# Altium schematic sheet FPGA BANK.SchDoc
size A3
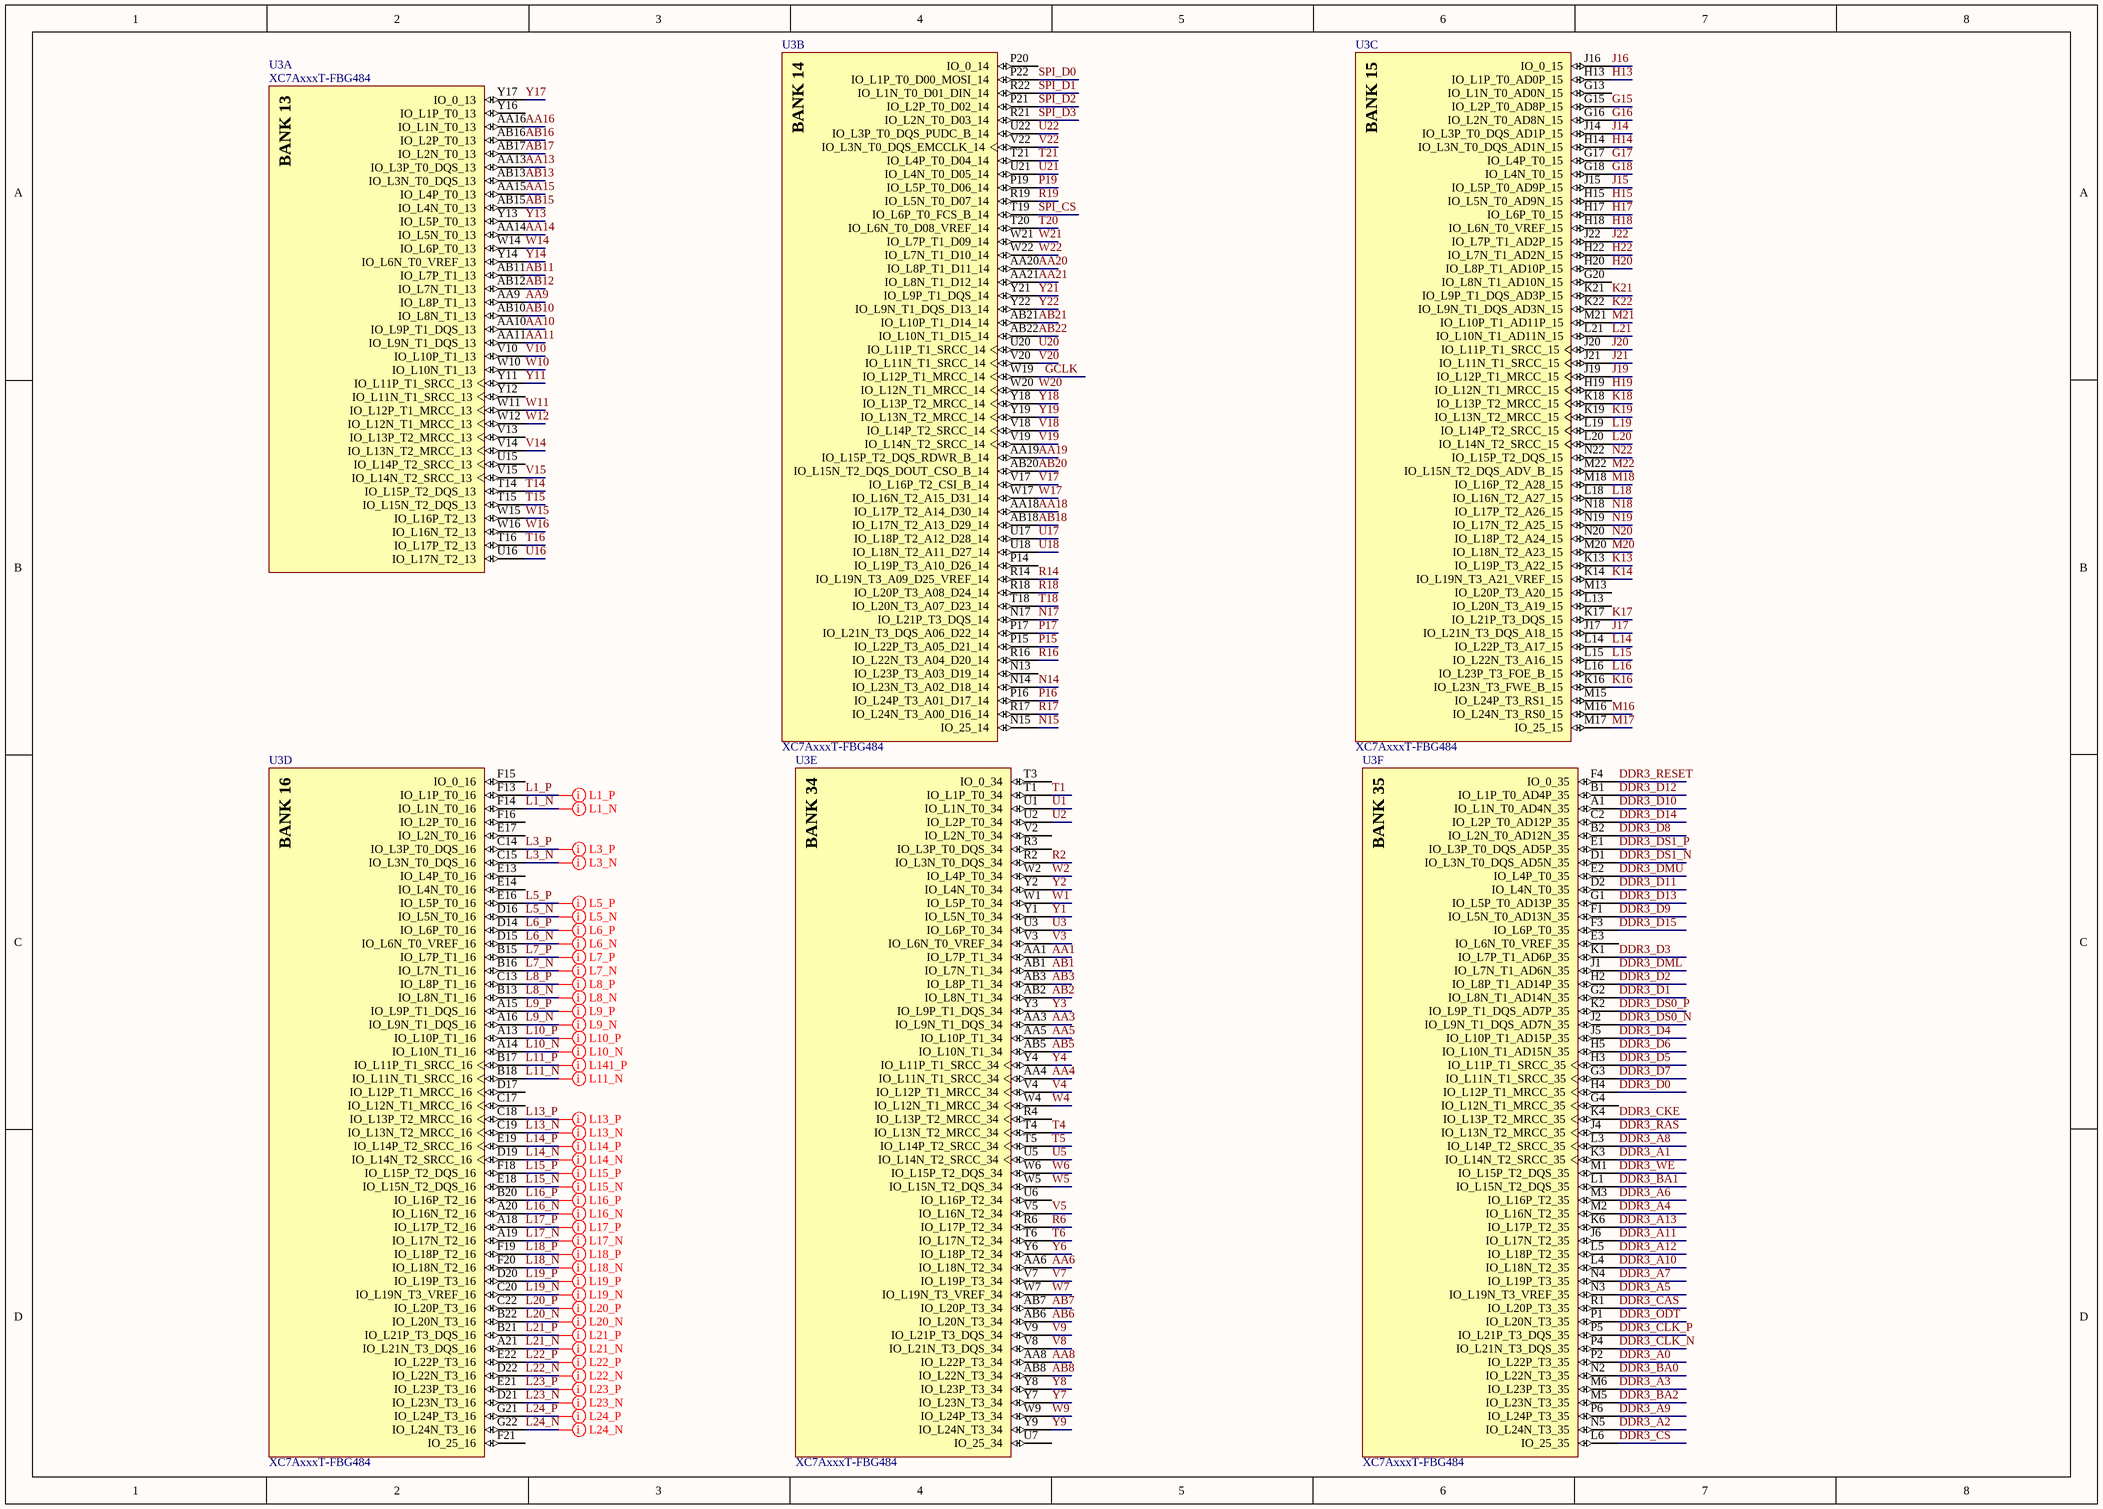
[diagram p0: FPGA BANK.SchDoc]

## Parts
U3  XC7AxxxT-FBG484  [FBG484]  (parts A,B,C,D,E,F of 11)

## Nets
AA1: U3.AA1(IO_L7P_T1_34)
AA3: U3.AA3(IO_L9N_T1_DQS_34)
AA4: U3.AA4(IO_L11N_T1_SRCC_34)
AA5: U3.AA5(IO_L10P_T1_34)
AA6: U3.AA6(IO_L18N_T2_34)
AA8: U3.AA8(IO_L22P_T3_34)
AA9: U3.AA9(IO_L8P_T1_13)
AA10: U3.AA10(IO_L9P_T1_DQS_13)
AA11: U3.AA11(IO_L9N_T1_DQS_13)
AA13: U3.AA13(IO_L3P_T0_DQS_13)
AA14: U3.AA14(IO_L5N_T0_13)
AA15: U3.AA15(IO_L4P_T0_13)
AA16: U3.AA16(IO_L1N_T0_13)
AA18: U3.AA18(IO_L17P_T2_A14_D30_14)
AA19: U3.AA19(IO_L15P_T2_DQS_RDWR_B_14)
AA20: U3.AA20(IO_L8P_T1_D11_14)
AA21: U3.AA21(IO_L8N_T1_D12_14)
AB1: U3.AB1(IO_L7N_T1_34)
AB2: U3.AB2(IO_L8N_T1_34)
AB3: U3.AB3(IO_L8P_T1_34)
AB5: U3.AB5(IO_L10N_T1_34)
AB6: U3.AB6(IO_L20N_T3_34)
AB7: U3.AB7(IO_L20P_T3_34)
AB8: U3.AB8(IO_L22N_T3_34)
AB10: U3.AB10(IO_L8N_T1_13)
AB11: U3.AB11(IO_L7P_T1_13)
AB12: U3.AB12(IO_L7N_T1_13)
AB13: U3.AB13(IO_L3N_T0_DQS_13)
AB15: U3.AB15(IO_L4N_T0_13)
AB16: U3.AB16(IO_L2P_T0_13)
AB17: U3.AB17(IO_L2N_T0_13)
AB18: U3.AB18(IO_L17N_T2_A13_D29_14)
AB20: U3.AB20(IO_L15N_T2_DQS_DOUT_CSO_B_14)
AB21: U3.AB21(IO_L10P_T1_D14_14)
AB22: U3.AB22(IO_L10N_T1_D15_14)
DDR3_A0: U3.P2(IO_L22P_T3_35)
DDR3_A1: U3.K3(IO_L14N_T2_SRCC_35)
DDR3_A2: U3.N5(IO_L24N_T3_35)
DDR3_A3: U3.M6(IO_L23P_T3_35)
DDR3_A4: U3.M2(IO_L16N_T2_35)
DDR3_A5: U3.N3(IO_L19N_T3_VREF_35)
DDR3_A6: U3.M3(IO_L16P_T2_35)
DDR3_A7: U3.N4(IO_L19P_T3_35)
DDR3_A8: U3.L3(IO_L14P_T2_SRCC_35)
DDR3_A9: U3.P6(IO_L24P_T3_35)
DDR3_A10: U3.L4(IO_L18N_T2_35)
DDR3_A11: U3.J6(IO_L17N_T2_35)
DDR3_A12: U3.L5(IO_L18P_T2_35)
DDR3_A13: U3.K6(IO_L17P_T2_35)
DDR3_BA0: U3.N2(IO_L22N_T3_35)
DDR3_BA1: U3.L1(IO_L15N_T2_DQS_35)
DDR3_BA2: U3.M5(IO_L23N_T3_35)
DDR3_CAS: U3.R1(IO_L20P_T3_35)
DDR3_CKE: U3.K4(IO_L13P_T2_MRCC_35)
DDR3_CLK_N: U3.P4(IO_L21N_T3_DQS_35)
DDR3_CLK_P: U3.P5(IO_L21P_T3_DQS_35)
DDR3_CS: U3.L6(IO_25_35)
DDR3_D0: U3.H4(IO_L12P_T1_MRCC_35)
DDR3_D1: U3.G2(IO_L8N_T1_AD14N_35)
DDR3_D2: U3.H2(IO_L8P_T1_AD14P_35)
DDR3_D3: U3.K1(IO_L7P_T1_AD6P_35)
DDR3_D4: U3.J5(IO_L10P_T1_AD15P_35)
DDR3_D5: U3.H3(IO_L11P_T1_SRCC_35)
DDR3_D6: U3.H5(IO_L10N_T1_AD15N_35)
DDR3_D7: U3.G3(IO_L11N_T1_SRCC_35)
DDR3_D8: U3.B2(IO_L2N_T0_AD12N_35)
DDR3_D9: U3.F1(IO_L5N_T0_AD13N_35)
DDR3_D10: U3.A1(IO_L1N_T0_AD4N_35)
DDR3_D11: U3.D2(IO_L4N_T0_35)
DDR3_D12: U3.B1(IO_L1P_T0_AD4P_35)
DDR3_D13: U3.G1(IO_L5P_T0_AD13P_35)
DDR3_D14: U3.C2(IO_L2P_T0_AD12P_35)
DDR3_D15: U3.F3(IO_L6P_T0_35)
DDR3_DML: U3.J1(IO_L7N_T1_AD6N_35)
DDR3_DMU: U3.E2(IO_L4P_T0_35)
DDR3_DS0_N: U3.J2(IO_L9N_T1_DQS_AD7N_35)
DDR3_DS0_P: U3.K2(IO_L9P_T1_DQS_AD7P_35)
DDR3_DS1_N: U3.D1(IO_L3N_T0_DQS_AD5N_35)
DDR3_DS1_P: U3.E1(IO_L3P_T0_DQS_AD5P_35)
DDR3_ODT: U3.P1(IO_L20N_T3_35)
DDR3_RAS: U3.J4(IO_L13N_T2_MRCC_35)
DDR3_RESET: U3.F4(IO_0_35)
DDR3_WE: U3.M1(IO_L15P_T2_DQS_35)
G15: U3.G15(IO_L2P_T0_AD8P_15)
G16: U3.G16(IO_L2N_T0_AD8N_15)
G17: U3.G17(IO_L4P_T0_15)
G18: U3.G18(IO_L4N_T0_15)
GCLK: U3.W19(IO_L12P_T1_MRCC_14)
H13: U3.H13(IO_L1P_T0_AD0P_15)
H14: U3.H14(IO_L3N_T0_DQS_AD1N_15)
H15: U3.H15(IO_L5N_T0_AD9N_15)
H17: U3.H17(IO_L6P_T0_15)
H18: U3.H18(IO_L6N_T0_VREF_15)
H19: U3.H19(IO_L12N_T1_MRCC_15)
H20: U3.H20(IO_L8P_T1_AD10P_15)
H22: U3.H22(IO_L7N_T1_AD2N_15)
J14: U3.J14(IO_L3P_T0_DQS_AD1P_15)
J15: U3.J15(IO_L5P_T0_AD9P_15)
J16: U3.J16(IO_0_15)
J17: U3.J17(IO_L21N_T3_DQS_A18_15)
J19: U3.J19(IO_L12P_T1_MRCC_15)
J20: U3.J20(IO_L11P_T1_SRCC_15)
J21: U3.J21(IO_L11N_T1_SRCC_15)
J22: U3.J22(IO_L7P_T1_AD2P_15)
K13: U3.K13(IO_L19P_T3_A22_15)
K14: U3.K14(IO_L19N_T3_A21_VREF_15)
K16: U3.K16(IO_L23N_T3_FWE_B_15)
K17: U3.K17(IO_L21P_T3_DQS_15)
K18: U3.K18(IO_L13P_T2_MRCC_15)
K19: U3.K19(IO_L13N_T2_MRCC_15)
K21: U3.K21(IO_L9P_T1_DQS_AD3P_15)
K22: U3.K22(IO_L9N_T1_DQS_AD3N_15)
L1_N: U3.F14(IO_L1N_T0_16)
L1_P: U3.F13(IO_L1P_T0_16)
L3_N: U3.C15(IO_L3N_T0_DQS_16)
L3_P: U3.C14(IO_L3P_T0_DQS_16)
L5_N: U3.D16(IO_L5N_T0_16)
L5_P: U3.E16(IO_L5P_T0_16)
L6_N: U3.D15(IO_L6N_T0_VREF_16)
L6_P: U3.D14(IO_L6P_T0_16)
L7_N: U3.B16(IO_L7N_T1_16)
L7_P: U3.B15(IO_L7P_T1_16)
L8_N: U3.B13(IO_L8N_T1_16)
L8_P: U3.C13(IO_L8P_T1_16)
L9_N: U3.A16(IO_L9N_T1_DQS_16)
L9_P: U3.A15(IO_L9P_T1_DQS_16)
L10_N: U3.A14(IO_L10N_T1_16)
L10_P: U3.A13(IO_L10P_T1_16)
L11_N: U3.B18(IO_L11N_T1_SRCC_16)
L11_P: U3.B17(IO_L11P_T1_SRCC_16)
L13_N: U3.C19(IO_L13N_T2_MRCC_16)
L13_P: U3.C18(IO_L13P_T2_MRCC_16)
L14: U3.L14(IO_L22P_T3_A17_15)
L14_N: U3.D19(IO_L14N_T2_SRCC_16)
L14_P: U3.E19(IO_L14P_T2_SRCC_16)
L15: U3.L15(IO_L22N_T3_A16_15)
L15_N: U3.E18(IO_L15N_T2_DQS_16)
L15_P: U3.F18(IO_L15P_T2_DQS_16)
L16: U3.L16(IO_L23P_T3_FOE_B_15)
L16_N: U3.A20(IO_L16N_T2_16)
L16_P: U3.B20(IO_L16P_T2_16)
L17_N: U3.A19(IO_L17N_T2_16)
L17_P: U3.A18(IO_L17P_T2_16)
L18: U3.L18(IO_L16N_T2_A27_15)
L18_N: U3.F20(IO_L18N_T2_16)
L18_P: U3.F19(IO_L18P_T2_16)
L19: U3.L19(IO_L14P_T2_SRCC_15)
L19_N: U3.C20(IO_L19N_T3_VREF_16)
L19_P: U3.D20(IO_L19P_T3_16)
L20: U3.L20(IO_L14N_T2_SRCC_15)
L20_N: U3.B22(IO_L20N_T3_16)
L20_P: U3.C22(IO_L20P_T3_16)
L21: U3.L21(IO_L10N_T1_AD11N_15)
L21_N: U3.A21(IO_L21N_T3_DQS_16)
L21_P: U3.B21(IO_L21P_T3_DQS_16)
L22_N: U3.D22(IO_L22N_T3_16)
L22_P: U3.E22(IO_L22P_T3_16)
L23_N: U3.D21(IO_L23N_T3_16)
L23_P: U3.E21(IO_L23P_T3_16)
L24_N: U3.G22(IO_L24N_T3_16)
L24_P: U3.G21(IO_L24P_T3_16)
M16: U3.M16(IO_L24N_T3_RS0_15)
M17: U3.M17(IO_25_15)
M18: U3.M18(IO_L16P_T2_A28_15)
M20: U3.M20(IO_L18N_T2_A23_15)
M21: U3.M21(IO_L10P_T1_AD11P_15)
M22: U3.M22(IO_L15N_T2_DQS_ADV_B_15)
N14: U3.N14(IO_L23N_T3_A02_D18_14)
N15: U3.N15(IO_25_14)
N17: U3.N17(IO_L21P_T3_DQS_14)
N18: U3.N18(IO_L17P_T2_A26_15)
N19: U3.N19(IO_L17N_T2_A25_15)
N20: U3.N20(IO_L18P_T2_A24_15)
N22: U3.N22(IO_L15P_T2_DQS_15)
P15: U3.P15(IO_L22P_T3_A05_D21_14)
P16: U3.P16(IO_L24P_T3_A01_D17_14)
P17: U3.P17(IO_L21N_T3_DQS_A06_D22_14)
P19: U3.P19(IO_L5P_T0_D06_14)
R2: U3.R2(IO_L3N_T0_DQS_34)
R6: U3.R6(IO_L17P_T2_34)
R14: U3.R14(IO_L19N_T3_A09_D25_VREF_14)
R16: U3.R16(IO_L22N_T3_A04_D20_14)
R17: U3.R17(IO_L24N_T3_A00_D16_14)
R18: U3.R18(IO_L20P_T3_A08_D24_14)
R19: U3.R19(IO_L5N_T0_D07_14)
SPI_CS: U3.T19(IO_L6P_T0_FCS_B_14)
SPI_D0: U3.P22(IO_L1P_T0_D00_MOSI_14)
SPI_D1: U3.R22(IO_L1N_T0_D01_DIN_14)
SPI_D2: U3.P21(IO_L2P_T0_D02_14)
SPI_D3: U3.R21(IO_L2N_T0_D03_14)
T1: U3.T1(IO_L1P_T0_34)
T4: U3.T4(IO_L13N_T2_MRCC_34)
T5: U3.T5(IO_L14P_T2_SRCC_34)
T6: U3.T6(IO_L17N_T2_34)
T14: U3.T14(IO_L15P_T2_DQS_13)
T15: U3.T15(IO_L15N_T2_DQS_13)
T16: U3.T16(IO_L17P_T2_13)
T18: U3.T18(IO_L20N_T3_A07_D23_14)
T20: U3.T20(IO_L6N_T0_D08_VREF_14)
T21: U3.T21(IO_L4P_T0_D04_14)
U1: U3.U1(IO_L1N_T0_34)
U2: U3.U2(IO_L2P_T0_34)
U3: U3.U3(IO_L6P_T0_34)
U5: U3.U5(IO_L14N_T2_SRCC_34)
U16: U3.U16(IO_L17N_T2_13)
U17: U3.U17(IO_L18P_T2_A12_D28_14)
U18: U3.U18(IO_L18N_T2_A11_D27_14)
U20: U3.U20(IO_L11P_T1_SRCC_14)
U21: U3.U21(IO_L4N_T0_D05_14)
U22: U3.U22(IO_L3P_T0_DQS_PUDC_B_14)
V3: U3.V3(IO_L6N_T0_VREF_34)
V4: U3.V4(IO_L12P_T1_MRCC_34)
V5: U3.V5(IO_L16N_T2_34)
V7: U3.V7(IO_L19P_T3_34)
V8: U3.V8(IO_L21N_T3_DQS_34)
V9: U3.V9(IO_L21P_T3_DQS_34)
V10: U3.V10(IO_L10P_T1_13)
V14: U3.V14(IO_L13N_T2_MRCC_13)
V15: U3.V15(IO_L14N_T2_SRCC_13)
V17: U3.V17(IO_L16P_T2_CSI_B_14)
V18: U3.V18(IO_L14P_T2_SRCC_14)
V19: U3.V19(IO_L14N_T2_SRCC_14)
V20: U3.V20(IO_L11N_T1_SRCC_14)
V22: U3.V22(IO_L3N_T0_DQS_EMCCLK_14)
W1: U3.W1(IO_L5P_T0_34)
W2: U3.W2(IO_L4P_T0_34)
W4: U3.W4(IO_L12N_T1_MRCC_34)
W5: U3.W5(IO_L15N_T2_DQS_34)
W6: U3.W6(IO_L15P_T2_DQS_34)
W7: U3.W7(IO_L19N_T3_VREF_34)
W9: U3.W9(IO_L24P_T3_34)
W10: U3.W10(IO_L10N_T1_13)
W11: U3.W11(IO_L12P_T1_MRCC_13)
W12: U3.W12(IO_L12N_T1_MRCC_13)
W14: U3.W14(IO_L6P_T0_13)
W15: U3.W15(IO_L16P_T2_13)
W16: U3.W16(IO_L16N_T2_13)
W17: U3.W17(IO_L16N_T2_A15_D31_14)
W20: U3.W20(IO_L12N_T1_MRCC_14)
W21: U3.W21(IO_L7P_T1_D09_14)
W22: U3.W22(IO_L7N_T1_D10_14)
Y1: U3.Y1(IO_L5N_T0_34)
Y2: U3.Y2(IO_L4N_T0_34)
Y3: U3.Y3(IO_L9P_T1_DQS_34)
Y4: U3.Y4(IO_L11P_T1_SRCC_34)
Y6: U3.Y6(IO_L18P_T2_34)
Y7: U3.Y7(IO_L23N_T3_34)
Y8: U3.Y8(IO_L23P_T3_34)
Y9: U3.Y9(IO_L24N_T3_34)
Y11: U3.Y11(IO_L11P_T1_SRCC_13)
Y13: U3.Y13(IO_L5P_T0_13)
Y14: U3.Y14(IO_L6N_T0_VREF_13)
Y17: U3.Y17(IO_0_13)
Y18: U3.Y18(IO_L13P_T2_MRCC_14)
Y19: U3.Y19(IO_L13N_T2_MRCC_14)
Y21: U3.Y21(IO_L9P_T1_DQS_14)
Y22: U3.Y22(IO_L9N_T1_DQS_D13_14)

Not connected (* = marked no-connect by the designer): U3 C17(IO_L12N_T1_MRCC_16) D17(IO_L12P_T1_MRCC_16) E3(IO_L6N_T0_VREF_35) E13(IO_L4P_T0_16) E14(IO_L4N_T0_16) E17(IO_L2N_T0_16) F15(IO_0_16) F16(IO_L2P_T0_16) F21(IO_25_16) G4(IO_L12N_T1_MRCC_35) G13(IO_L1N_T0_AD0N_15) G20(IO_L8N_T1_AD10N_15) L13(IO_L20N_T3_A19_15) M13(IO_L20P_T3_A20_15) M15(IO_L24P_T3_RS1_15) N13(IO_L23P_T3_A03_D19_14) P14(IO_L19P_T3_A10_D26_14) P20(IO_0_14) R3(IO_L3P_T0_DQS_34) R4(IO_L13P_T2_MRCC_34) T3(IO_0_34) U6(IO_L16P_T2_34) U7(IO_25_34) U15(IO_L14P_T2_SRCC_13) V2(IO_L2N_T0_34) V13(IO_L13P_T2_MRCC_13) Y12(IO_L11N_T1_SRCC_13) Y16(IO_L1P_T0_13)

## Layout directives
differential pair: L1_N, L1_P, L3_N, L3_P, L5_N, L5_P, L6_N, L6_P, L7_N, L7_P, L8_N, L8_P, L9_N, L9_P, L10_N, L10_P, L11_N, L11_P, L13_N, L13_P, L14_N, L14_P, L15_N, L15_P, L16_N, L16_P, L17_N, L17_P, L18_N, L18_P, L19_N, L19_P, L20_N, L20_P, L21_N, L21_P, L22_N, L22_P, L23_N, L23_P, L24_N, L24_P

## Notes on the sheet
- (in symbol XC7A200T-1FBG484I, part A) BANK 13
- (in symbol XC7A200T-1FBG484I, part B) BANK 14
- (in symbol XC7A200T-1FBG484I, part C) BANK 15
- (in symbol XC7A200T-1FBG484I, part D) BANK 16
- (in symbol XC7A200T-1FBG484I, part E) BANK 34
- (in symbol XC7A200T-1FBG484I, part F) BANK 35

## Library data of the parts
U3 = XC7A200T-1FBG484I: Artix-7 FPGA, 285 User I/Os, 4 GTP, 484-Ball BGA, Speed Grade 1, Industrial Grade, Pb-Free; Manufacturer: Xilinx; Block RAM Blocks (18Kb): 730; Block RAM Blocks (36Kb): 365; Block RAM Blocks (Max Kb): 13140; CLBs (Slices): 33650; Clock Mgmt Tiles (CMTs): 10; DSP48E1 Slices: 740; Logic Cells: 215360; Max User I/O: 500; Speed Grade: -1; DatasheetVersion: v1.12; PackageVersion: Rev 1.8; PackageReference: FBG484; PackageDescription: Flip-Chip Lidless BGA, Body 23 x 23 mm, 1.0 mm Pitch; CLBs (Max Distributed RAM Kb): 2888; Generic Part Number: XC7A200T; RoHS: Pb-Free; Mounting Technology: Surface Mount; Code_JEDEC: MS-034; PartNumber: XC7A200T-1FBG484I; ComponentLink1Description: Datasheet; ComponentLink1URL: http://www.xilinx.com/support/documentation/data_sheets/ds180_7Series_Overview.pdf; ComponentLink2Description: Package Specification; ComponentLink2URL: http://www.xilinx.com/support/documentation/user_guides/ug475_7Series_Pkg_Pinout.pdf; ComponentLink3Description: DC and Switching Characteristics; ComponentLink3URL: http://www.xilinx.com/support/documentation/data_sheets/ds181_Artix_7_Data_Sheet.pdf; ComponentLink4Description: Package File; ComponentLink4URL: http://www.xilinx.com/support/packagefiles/a7packages/xc7a200tfbg484pkg.txt; ComponentLink5Description: Packaging and Pinout; ComponentLink5URL: http://www.xilinx.com/support/documentation/user_guides/ug475_7Series_Pkg_Pinout.pdf